# Altium schematic sheet 09-PL BANKS 34 & 35.SchDoc
size 513 x 386 mm
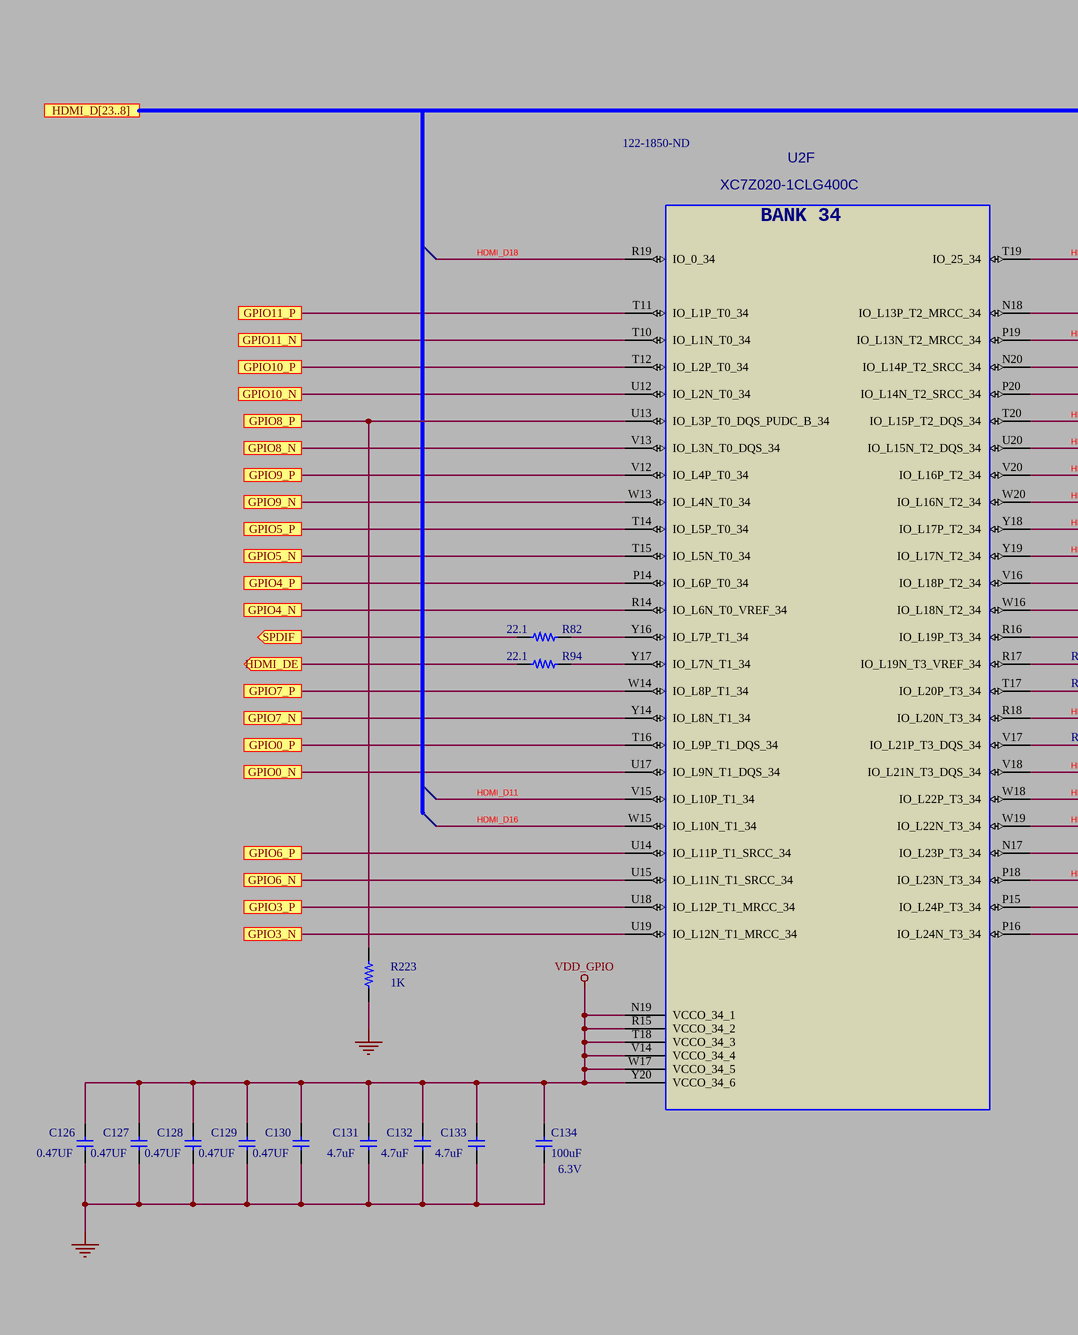
[diagram p0: 09-PL BANKS 34 & 35.SchDoc, left]
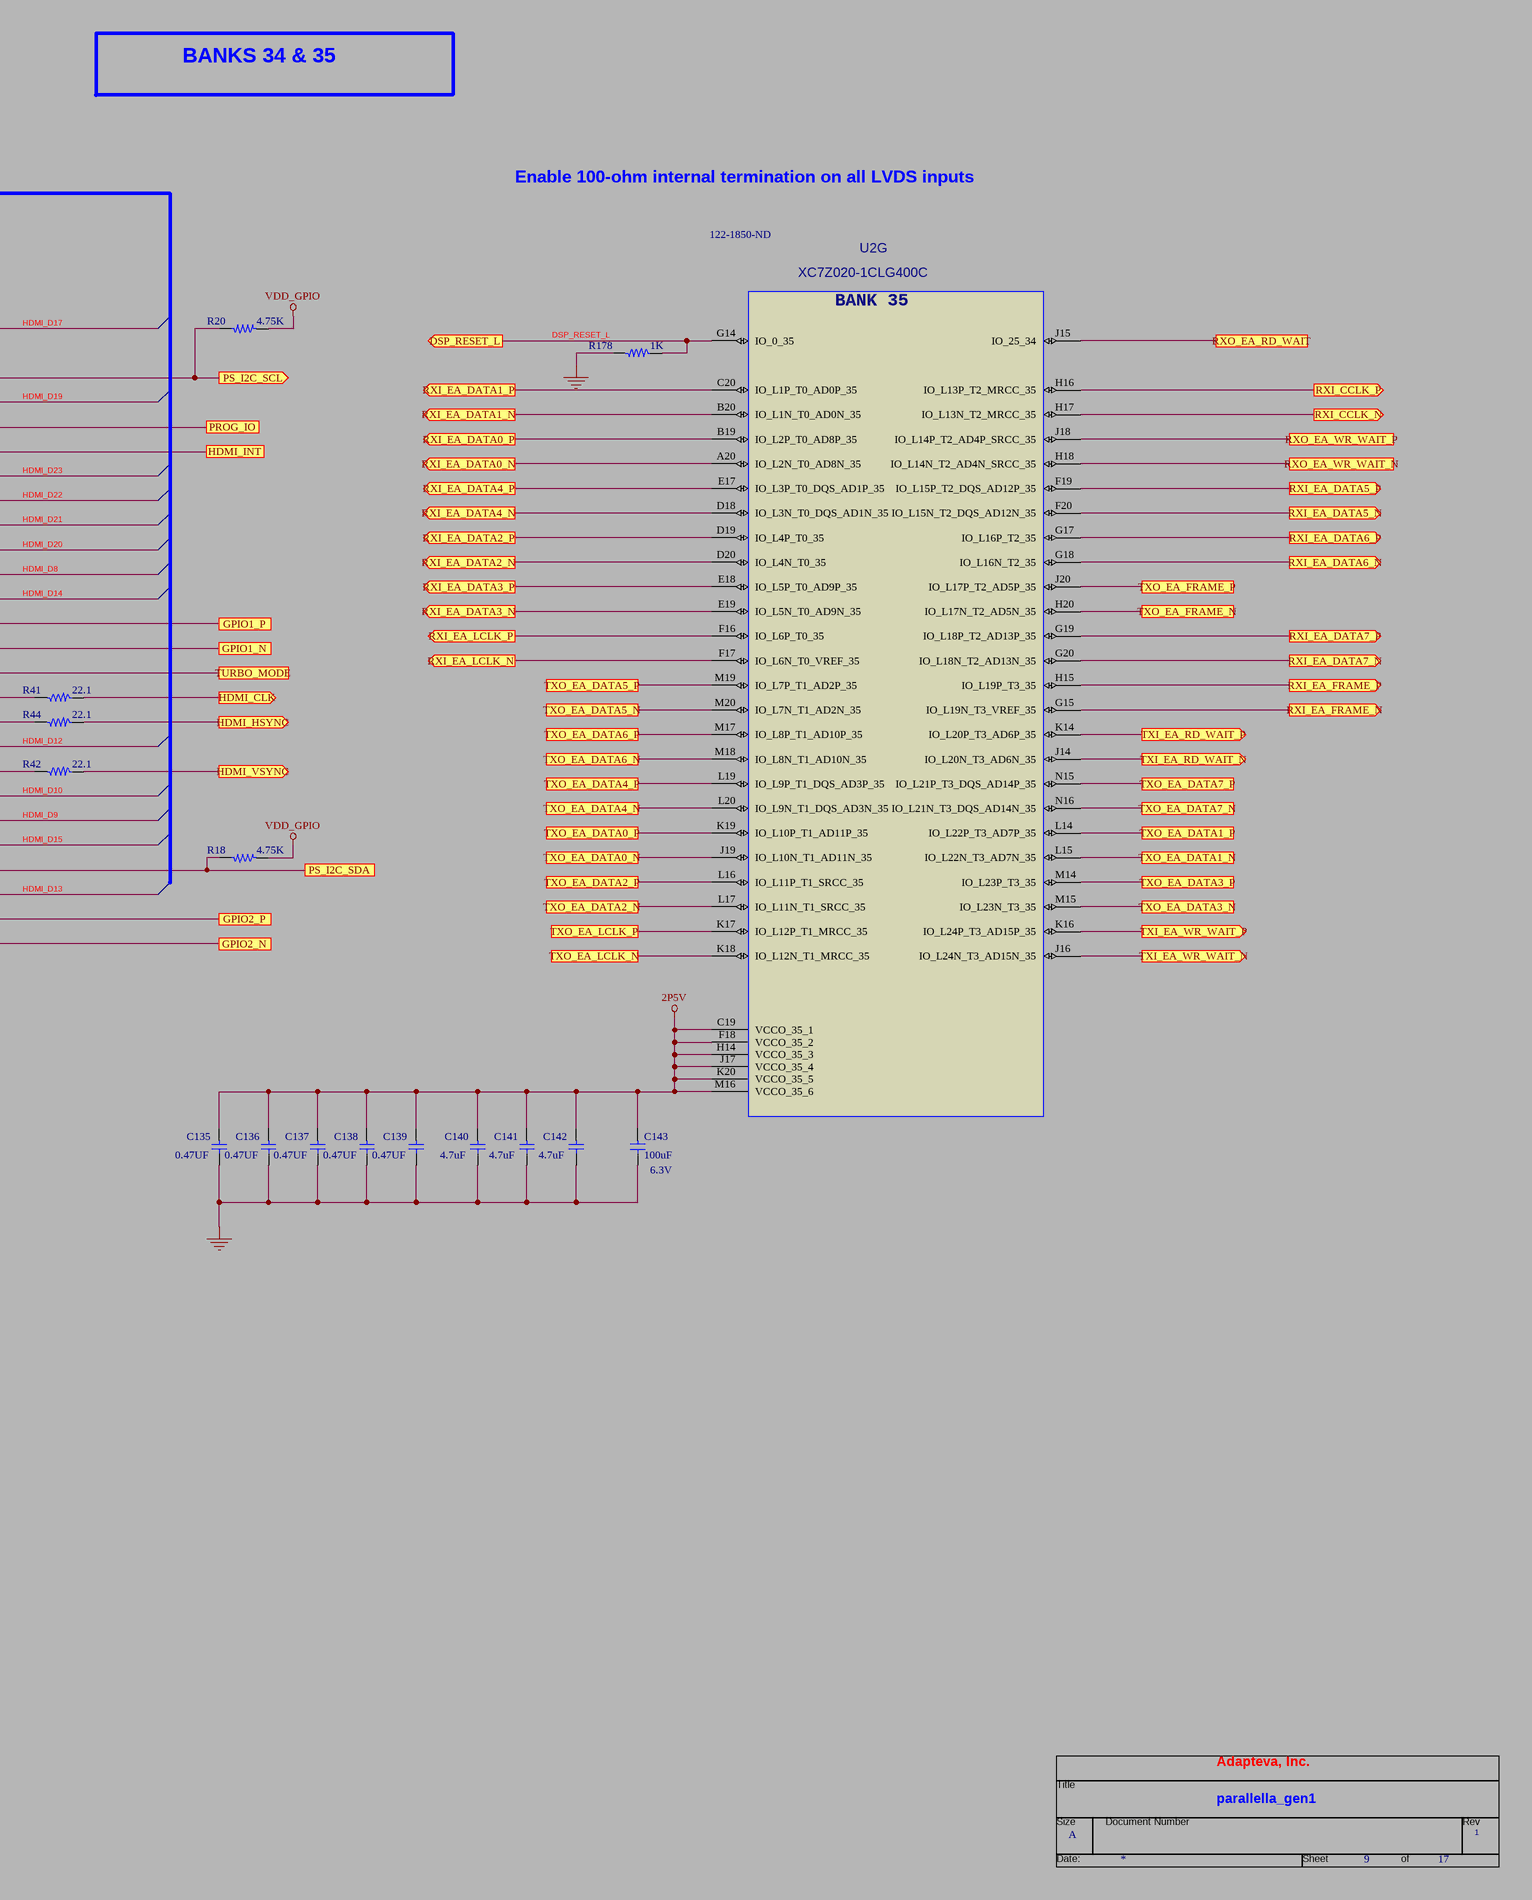
[diagram p1: 09-PL BANKS 34 & 35.SchDoc, right]

## Parts
*  RevCode: 1  Title: parallella_gen1  Page Size: A  Page Number: 9  Page Count: 17  OrgAddr1: Adapteva, Inc.  (hidden comment: TitleBlock0)  (graphical)
C126  0.47UF  [C0402]
C127  0.47UF  [C0402]
C128  0.47UF  [C0402]
C129  0.47UF  [C0402]
C130  0.47UF  [C0402]
C131  4.7uF  [C0402]
C132  4.7uF  [C0402]
C133  4.7uF  [C0402]
C134  100uF  VOLTAGE: 6.3V  [C1210]
C135  0.47UF  [C0402]
C136  0.47UF  [C0402]
C137  0.47UF  [C0402]
C138  0.47UF  [C0402]
C139  0.47UF  [C0402]
C140  4.7uF  [C0402]
C141  4.7uF  [C0402]
C142  4.7uF  [C0402]
C143  100uF  VOLTAGE: 6.3V  [C1210]
R18  4.75K  [R0402]
R20  4.75K  [R0402]
R41  22.1  [R0402]
R42  22.1  [R0402]
R44  22.1  [R0402]
R82  22.1  [R0402]
R94  22.1  [R0402]
R178  1K  [R0402]
R223  1K  [R0402]
U2  Vendor PN: XC7Z020-1CLG400C  Supplier Part Number 1: 122-1850-ND  [CBGA400_17SQ_1P6H_P8MMP]  (hidden comment: 7Z020-CLG400)  (parts F,G of 8)

## Ports
DSP_RESET_L (out), GPIO0_N, GPIO0_P, GPIO1_N, GPIO1_P, GPIO2_N, GPIO2_P, GPIO3_N, GPIO3_P, GPIO4_N, GPIO4_P, GPIO5_N, GPIO5_P, GPIO6_N, GPIO6_P, GPIO7_N, GPIO7_P, GPIO8_N, GPIO8_P, GPIO9_N, GPIO9_P, GPIO10_N, GPIO10_P, GPIO11_N, GPIO11_P, HDMI_CLK (out), HDMI_D[23..8], HDMI_DE (out), HDMI_HSYNC (out), HDMI_INT, HDMI_VSYNC (out), PROG_IO, PS_I2C_SCL (out), PS_I2C_SDA, RXI_CCLK_N (out), RXI_CCLK_P (out), RXI_EA_DATA0_N (out), RXI_EA_DATA0_P (out), RXI_EA_DATA1_N (out), RXI_EA_DATA1_P (out), RXI_EA_DATA2_N (out), RXI_EA_DATA2_P (out), RXI_EA_DATA3_N (out), RXI_EA_DATA3_P (out), RXI_EA_DATA4_N (out), RXI_EA_DATA4_P (out), RXI_EA_DATA5_N (out), RXI_EA_DATA5_P (out), RXI_EA_DATA6_N (out), RXI_EA_DATA6_P (out), RXI_EA_DATA7_N (out), RXI_EA_DATA7_P (out), RXI_EA_FRAME_N (out), RXI_EA_FRAME_P (out), RXI_EA_LCLK_N (out), RXI_EA_LCLK_P (out), RXO_EA_RD_WAIT, RXO_EA_WR_WAIT_N, RXO_EA_WR_WAIT_P, SPDIF (out), TURBO_MODE, TXI_EA_RD_WAIT_N (out), TXI_EA_RD_WAIT_P (out), TXI_EA_WR_WAIT_N (out), TXI_EA_WR_WAIT_P (out), TXO_EA_DATA0_N, TXO_EA_DATA0_P, TXO_EA_DATA1_N, TXO_EA_DATA1_P, TXO_EA_DATA2_N, TXO_EA_DATA2_P, TXO_EA_DATA3_N, TXO_EA_DATA3_P, TXO_EA_DATA4_N, TXO_EA_DATA4_P, TXO_EA_DATA5_N, TXO_EA_DATA5_P, TXO_EA_DATA6_N, TXO_EA_DATA6_P, TXO_EA_DATA7_N, TXO_EA_DATA7_P, TXO_EA_FRAME_N, TXO_EA_FRAME_P, TXO_EA_LCLK_N, TXO_EA_LCLK_P

## Nets
2P5V: C135.1 C136.1 C137.1 C138.1 C139.1 C140.1 C141.1 C142.1 C143.1 U2.C19(VCCO_35_1) U2.F18(VCCO_35_2) U2.H14(VCCO_35_3) U2.J17(VCCO_35_4) U2.K20(VCCO_35_5) U2.M16(VCCO_35_6)
GND: C126.2 C127.2 C128.2 C129.2 C130.2 C131.2 C132.2 C133.2 C134.2 C135.2 C136.2 C137.2 C138.2 C139.2 C140.2 C141.2 C142.2 C143.2 R178.1 R223.1
VDD_GPIO: C126.1 C127.1 C128.1 C129.1 C130.1 C131.1 C132.1 C133.1 C134.1 R18.1 R20.1 U2.N19(VCCO_34_1) U2.R15(VCCO_34_2) U2.T18(VCCO_34_3) U2.V14(VCCO_34_4) U2.W17(VCCO_34_5) U2.Y20(VCCO_34_6)
DSP_RESET_L: R178.2 U2.G14(IO_0_35) ; port DSP_RESET_L
GPIO0_N: U2.U17(IO_L9N_T1_DQS_34) ; port GPIO0_N
GPIO0_P: U2.T16(IO_L9P_T1_DQS_34) ; port GPIO0_P
GPIO1_N: U2.W16(IO_L18N_T2_34) ; port GPIO1_N
GPIO1_P: U2.V16(IO_L18P_T2_34) ; port GPIO1_P
GPIO2_N: U2.P16(IO_L24N_T3_34) ; port GPIO2_N
GPIO2_P: U2.P15(IO_L24P_T3_34) ; port GPIO2_P
GPIO3_N: U2.U19(IO_L12N_T1_MRCC_34) ; port GPIO3_N
GPIO3_P: U2.U18(IO_L12P_T1_MRCC_34) ; port GPIO3_P
GPIO4_N: U2.R14(IO_L6N_T0_VREF_34) ; port GPIO4_N
GPIO4_P: U2.P14(IO_L6P_T0_34) ; port GPIO4_P
GPIO5_N: U2.T15(IO_L5N_T0_34) ; port GPIO5_N
GPIO5_P: U2.T14(IO_L5P_T0_34) ; port GPIO5_P
GPIO6_N: U2.U15(IO_L11N_T1_SRCC_34) ; port GPIO6_N
GPIO6_P: U2.U14(IO_L11P_T1_SRCC_34) ; port GPIO6_P
GPIO7_N: U2.Y14(IO_L8N_T1_34) ; port GPIO7_N
GPIO7_P: U2.W14(IO_L8P_T1_34) ; port GPIO7_P
GPIO8_N: U2.V13(IO_L3N_T0_DQS_34) ; port GPIO8_N
GPIO8_P: R223.2 U2.U13(IO_L3P_T0_DQS_PUDC_B_34) ; port GPIO8_P
GPIO9_N: U2.W13(IO_L4N_T0_34) ; port GPIO9_N
GPIO9_P: U2.V12(IO_L4P_T0_34) ; port GPIO9_P
GPIO10_N: U2.U12(IO_L2N_T0_34) ; port GPIO10_N
GPIO10_P: U2.T12(IO_L2P_T0_34) ; port GPIO10_P
GPIO11_N: U2.T10(IO_L1N_T0_34) ; port GPIO11_N
GPIO11_P: U2.T11(IO_L1P_T0_34) ; port GPIO11_P
HDMI_CLK: R41.2 ; port HDMI_CLK
HDMI_D8: U2.Y18(IO_L17P_T2_34)
HDMI_D9: U2.W18(IO_L22P_T3_34)
HDMI_D10: U2.V18(IO_L21N_T3_DQS_34)
HDMI_D11: U2.V15(IO_L10P_T1_34)
HDMI_D12: U2.R18(IO_L20N_T3_34)
HDMI_D13: U2.P18(IO_L23N_T3_34)
HDMI_D14: U2.Y19(IO_L17N_T2_34)
HDMI_D15: U2.W19(IO_L22N_T3_34)
HDMI_D16: U2.W15(IO_L10N_T1_34)
HDMI_D17: U2.T19(IO_25_34)
HDMI_D18: U2.R19(IO_0_34)
HDMI_D19: U2.P19(IO_L13N_T2_MRCC_34)
HDMI_D20: U2.W20(IO_L16N_T2_34)
HDMI_D21: U2.V20(IO_L16P_T2_34)
HDMI_D22: U2.U20(IO_L15N_T2_DQS_34)
HDMI_D23: U2.T20(IO_L15P_T2_DQS_34)
HDMI_DE: R94.2 ; port HDMI_DE
HDMI_HSYNC: R44.2 ; port HDMI_HSYNC
HDMI_INT: U2.P20(IO_L14N_T2_SRCC_34) ; port HDMI_INT
HDMI_VSYNC: R42.2 ; port HDMI_VSYNC
PROG_IO: U2.N20(IO_L14P_T2_SRCC_34) ; port PROG_IO
PS_I2C_SCL: R20.2 U2.N18(IO_L13P_T2_MRCC_34) ; port PS_I2C_SCL
PS_I2C_SDA: R18.2 U2.N17(IO_L23P_T3_34) ; port PS_I2C_SDA
RXI_CCLK_N: U2.H17(IO_L13N_T2_MRCC_35) ; port RXI_CCLK_N
RXI_CCLK_P: U2.H16(IO_L13P_T2_MRCC_35) ; port RXI_CCLK_P
RXI_EA_DATA0_N: U2.A20(IO_L2N_T0_AD8N_35) ; port RXI_EA_DATA0_N
RXI_EA_DATA0_P: U2.B19(IO_L2P_T0_AD8P_35) ; port RXI_EA_DATA0_P
RXI_EA_DATA1_N: U2.B20(IO_L1N_T0_AD0N_35) ; port RXI_EA_DATA1_N
RXI_EA_DATA1_P: U2.C20(IO_L1P_T0_AD0P_35) ; port RXI_EA_DATA1_P
RXI_EA_DATA2_N: U2.D20(IO_L4N_T0_35) ; port RXI_EA_DATA2_N
RXI_EA_DATA2_P: U2.D19(IO_L4P_T0_35) ; port RXI_EA_DATA2_P
RXI_EA_DATA3_N: U2.E19(IO_L5N_T0_AD9N_35) ; port RXI_EA_DATA3_N
RXI_EA_DATA3_P: U2.E18(IO_L5P_T0_AD9P_35) ; port RXI_EA_DATA3_P
RXI_EA_DATA4_N: U2.D18(IO_L3N_T0_DQS_AD1N_35) ; port RXI_EA_DATA4_N
RXI_EA_DATA4_P: U2.E17(IO_L3P_T0_DQS_AD1P_35) ; port RXI_EA_DATA4_P
RXI_EA_DATA5_N: U2.F20(IO_L15N_T2_DQS_AD12N_35) ; port RXI_EA_DATA5_N
RXI_EA_DATA5_P: U2.F19(IO_L15P_T2_DQS_AD12P_35) ; port RXI_EA_DATA5_P
RXI_EA_DATA6_N: U2.G18(IO_L16N_T2_35) ; port RXI_EA_DATA6_N
RXI_EA_DATA6_P: U2.G17(IO_L16P_T2_35) ; port RXI_EA_DATA6_P
RXI_EA_DATA7_N: U2.G20(IO_L18N_T2_AD13N_35) ; port RXI_EA_DATA7_N
RXI_EA_DATA7_P: U2.G19(IO_L18P_T2_AD13P_35) ; port RXI_EA_DATA7_P
RXI_EA_FRAME_N: U2.G15(IO_L19N_T3_VREF_35) ; port RXI_EA_FRAME_N
RXI_EA_FRAME_P: U2.H15(IO_L19P_T3_35) ; port RXI_EA_FRAME_P
RXI_EA_LCLK_N: U2.F17(IO_L6N_T0_VREF_35) ; port RXI_EA_LCLK_N
RXI_EA_LCLK_P: U2.F16(IO_L6P_T0_35) ; port RXI_EA_LCLK_P
RXO_EA_RD_WAIT: U2.J15(IO_25_34) ; port RXO_EA_RD_WAIT
RXO_EA_WR_WAIT_N: U2.H18(IO_L14N_T2_AD4N_SRCC_35) ; port RXO_EA_WR_WAIT_N
RXO_EA_WR_WAIT_P: U2.J18(IO_L14P_T2_AD4P_SRCC_35) ; port RXO_EA_WR_WAIT_P
SPDIF: R82.2 ; port SPDIF
TURBO_MODE: U2.R16(IO_L19P_T3_34) ; port TURBO_MODE
TXI_EA_RD_WAIT_N: U2.J14(IO_L20N_T3_AD6N_35) ; port TXI_EA_RD_WAIT_N
TXI_EA_RD_WAIT_P: U2.K14(IO_L20P_T3_AD6P_35) ; port TXI_EA_RD_WAIT_P
TXI_EA_WR_WAIT_N: U2.J16(IO_L24N_T3_AD15N_35) ; port TXI_EA_WR_WAIT_N
TXI_EA_WR_WAIT_P: U2.K16(IO_L24P_T3_AD15P_35) ; port TXI_EA_WR_WAIT_P
TXO_EA_DATA0_N: U2.J19(IO_L10N_T1_AD11N_35) ; port TXO_EA_DATA0_N
TXO_EA_DATA0_P: U2.K19(IO_L10P_T1_AD11P_35) ; port TXO_EA_DATA0_P
TXO_EA_DATA1_N: U2.L15(IO_L22N_T3_AD7N_35) ; port TXO_EA_DATA1_N
TXO_EA_DATA1_P: U2.L14(IO_L22P_T3_AD7P_35) ; port TXO_EA_DATA1_P
TXO_EA_DATA2_N: U2.L17(IO_L11N_T1_SRCC_35) ; port TXO_EA_DATA2_N
TXO_EA_DATA2_P: U2.L16(IO_L11P_T1_SRCC_35) ; port TXO_EA_DATA2_P
TXO_EA_DATA3_N: U2.M15(IO_L23N_T3_35) ; port TXO_EA_DATA3_N
TXO_EA_DATA3_P: U2.M14(IO_L23P_T3_35) ; port TXO_EA_DATA3_P
TXO_EA_DATA4_N: U2.L20(IO_L9N_T1_DQS_AD3N_35) ; port TXO_EA_DATA4_N
TXO_EA_DATA4_P: U2.L19(IO_L9P_T1_DQS_AD3P_35) ; port TXO_EA_DATA4_P
TXO_EA_DATA5_N: U2.M20(IO_L7N_T1_AD2N_35) ; port TXO_EA_DATA5_N
TXO_EA_DATA5_P: U2.M19(IO_L7P_T1_AD2P_35) ; port TXO_EA_DATA5_P
TXO_EA_DATA6_N: U2.M18(IO_L8N_T1_AD10N_35) ; port TXO_EA_DATA6_N
TXO_EA_DATA6_P: U2.M17(IO_L8P_T1_AD10P_35) ; port TXO_EA_DATA6_P
TXO_EA_DATA7_N: U2.N16(IO_L21N_T3_DQS_AD14N_35) ; port TXO_EA_DATA7_N
TXO_EA_DATA7_P: U2.N15(IO_L21P_T3_DQS_AD14P_35) ; port TXO_EA_DATA7_P
TXO_EA_FRAME_N: U2.H20(IO_L17N_T2_AD5N_35) ; port TXO_EA_FRAME_N
TXO_EA_FRAME_P: U2.J20(IO_L17P_T2_AD5P_35) ; port TXO_EA_FRAME_P
TXO_EA_LCLK_N: U2.K18(IO_L12N_T1_MRCC_35) ; port TXO_EA_LCLK_N
TXO_EA_LCLK_P: U2.K17(IO_L12P_T1_MRCC_35) ; port TXO_EA_LCLK_P
NetR41_1: R41.1 U2.R17(IO_L19N_T3_VREF_34)
NetR42_1: R42.1 U2.V17(IO_L21P_T3_DQS_34)
NetR44_1: R44.1 U2.T17(IO_L20P_T3_34)
NetR82_1: R82.1 U2.Y16(IO_L7P_T1_34)
NetR94_1: R94.1 U2.Y17(IO_L7N_T1_34)

## Notes on the sheet
- BANKS 34 & 35
- Enable 100-ohm internal termination on all LVDS inputs
- (in symbol TitleBlock0) Title; Size; Document Number; Rev; Date:; Sheet; of
- (in symbol ZYNQ_7Z020_CLG400, part F) BANK 34
- (in symbol ZYNQ_7Z020_CLG400, part G) BANK 35

## Library data of the parts
C126-C130 C135-C139 = CAP0402_0P47UF_X5R: CAP, 0402, 0.47UF, X5R, 16V; MFG PART NO: C1005X5R1C474K; MFG: TDK; ALT_SYMBOLS: C0402_BGA; DEVICE: CAP0402_0P47UF_X5R; Vendor: TDK; Vendor PN: C1005X5R1C474K; PCB Footprint: C0402
C131-C133 C140-C142 = CAP0402_4P7UF_X5R: CAP, 0402, 4.7UF, X5R, 6.3V; MFG PART NO: C1005X5R0J475K; MFG: TDK; ALT_SYMBOLS: C0402_BGA; DEVICE: CAP0402_4P7UF_X5R; Vendor: TDK; Vendor PN: C1005X5R0J475K; PCB Footprint: C0402
C134 C143 = CAP1210_100UF_X5R_LOESR: CAP, 1210, 100UF, X5R, 6.3V, LOW ESR; MFG PART NO: GRM32ER60J107ME20L; MFG: MURATA; DEVICE: CAP1210_100UF_X5R_LOESR; Vendor: MURATA; Vendor PN: GRM32ER60J107ME20L; PCB Footprint: C1210
R18 R20 = RES0402_4K75: RES, 0402, 4.75K, 1%; MFG PART NO: CRCW04024K75FKED; MFG: VISHAY; Vendor: VISHAY/DALE; ALT_SYMBOLS: R0402_BGA; DEVICE: RES0402_4K75; Vendor PN: CRCW04024K75FKED; PCB Footprint: R0402
R41 R42 R44 R82 R94 = RES0402_22R1: RES, 0402, 22.1, 1%; MFG PART NO: CRCW040222R1FKED; MFG: VISHAY; Vendor: VISHAY/DALE; ALT_SYMBOLS: R0402_BGA; DEVICE: RES0402_22R1; Vendor PN: CRCW040222R1FKED; PCB Footprint: R0402
R178 R223 = RES0402_1K: RES, 0402, 1K; MFG PART NO: CRCW04021K00FKED; ALT_SYMBOLS: R0402_BGA; MFG: VISHAY; Vendor: VISHAY/DALE; DEVICE: RES0402_1K; Vendor PN: CRCW04021K00FKED; PCB Footprint: R0402
U2 = ZYNQ_7Z020_CLG400: IC, EPP, XILINX, ZYNQ, 7Z020, CLG400; SPLIT_INST: TRUE; Vendor: XILINX; DEVICE: ZYNQ_7Z020_CLG400; PCB Footprint: CBGA400_17SQ_1P6H_P8MMP; Supplier 1: Digi-Key
* = TitleBlock0: Page Create Date: March  8, 1995; Page Modify Date: *